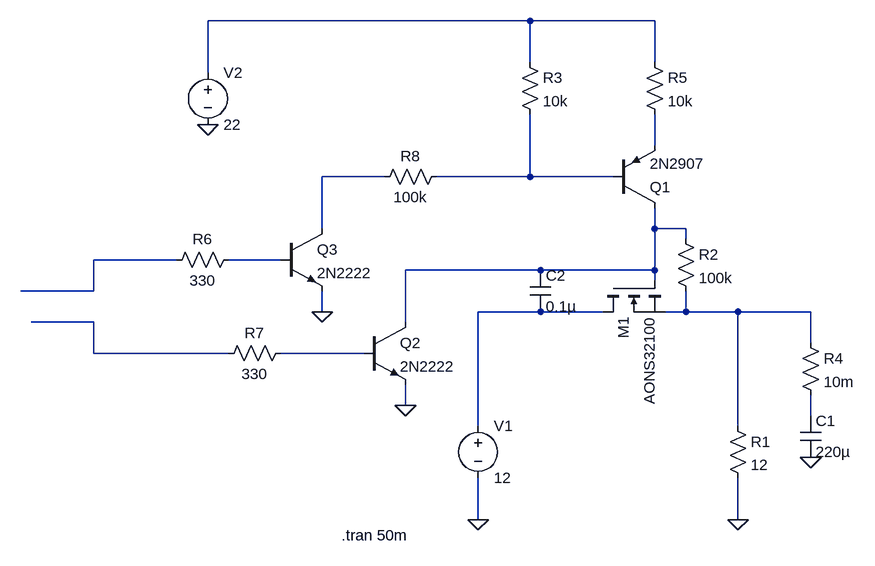
[diagram p0: schematic Power_Switch.asc]
Power_Switch.asc, the LTspice schematic file:
Version 4
SHEET 1 880 680
WIRE -16 -352 -512 -352
WIRE 176 -352 -16 -352
WIRE -16 -288 -16 -352
WIRE 176 -288 176 -352
WIRE -512 -272 -512 -352
WIRE 176 -160 176 -208
WIRE -240 -112 -336 -112
WIRE -16 -112 -16 -208
WIRE -16 -112 -160 -112
WIRE 112 -112 -16 -112
WIRE -336 -32 -336 -112
WIRE 176 -32 176 -64
WIRE 224 -32 176 -32
WIRE 224 -16 224 -32
WIRE -560 16 -688 16
WIRE -400 16 -480 16
WIRE 0 32 -208 32
WIRE 176 32 176 -32
WIRE 176 32 0 32
WIRE 176 48 176 32
WIRE -688 64 -688 16
WIRE -688 64 -800 64
WIRE -336 96 -336 64
WIRE 0 96 -96 96
WIRE 96 96 0 96
WIRE 224 96 224 64
WIRE 224 96 192 96
WIRE 304 96 224 96
WIRE 416 96 304 96
WIRE -688 112 -784 112
WIRE -208 112 -208 32
WIRE 416 144 416 96
WIRE -688 160 -688 112
WIRE -480 160 -688 160
WIRE -272 160 -400 160
WIRE -208 240 -208 208
WIRE 416 256 416 224
WIRE -96 272 -96 96
WIRE 304 272 304 96
WIRE -96 416 -96 352
WIRE 304 416 304 352
FLAG 304 416 0
FLAG -96 416 0
FLAG -512 -192 0
FLAG 416 320 0
FLAG -208 240 0
FLAG -336 96 0
SYMBOL voltage -96 256 R0
SYMATTR InstName V1
SYMATTR Value 12
SYMBOL res 288 256 R0
SYMATTR InstName R1
SYMATTR Value 12
SYMBOL voltage -512 -288 R0
SYMATTR InstName V2
SYMATTR Value 22
SYMBOL nmos 96 48 M90
SYMATTR InstName M1
SYMATTR Value AONS32100
SYMBOL res 208 -32 R0
SYMATTR InstName R2
SYMATTR Value 100k
SYMBOL cap 400 256 R0
SYMATTR InstName C1
SYMATTR Value 220µ
SYMBOL res 400 128 R0
SYMATTR InstName R4
SYMATTR Value 10m
SYMBOL cap -16 32 R0
SYMATTR InstName C2
SYMATTR Value 0.1µ
SYMBOL res 160 -304 R0
SYMATTR InstName R5
SYMATTR Value 10k
SYMBOL npn -272 112 R0
SYMATTR InstName Q2
SYMATTR Value 2N2222
SYMBOL pnp 112 -64 M180
SYMATTR InstName Q1
SYMATTR Value 2N2907
SYMBOL res -32 -304 R0
SYMATTR InstName R3
SYMATTR Value 10k
SYMBOL npn -400 -32 R0
SYMATTR InstName Q3
SYMATTR Value 2N2222
SYMBOL res -464 0 R90
WINDOW 0 0 56 VBottom 2
WINDOW 3 32 56 VTop 2
SYMATTR InstName R6
SYMATTR Value 330
SYMBOL res -384 144 R90
WINDOW 0 0 56 VBottom 2
WINDOW 3 32 56 VTop 2
SYMATTR InstName R7
SYMATTR Value 330
SYMBOL res -144 -128 R90
WINDOW 0 0 56 VBottom 2
WINDOW 3 32 56 VTop 2
SYMATTR InstName R8
SYMATTR Value 100k
TEXT -306 440 Left 2 !.tran 50m

The netlist it stands for:
* Power_Switch.asc
V1 N008 0 12
R1 N009 0 12
V2 N001 0 22
M1 N008 N005 N009 N009 AONS32100
R2 N005 N009 100k
C1 N012 0 220µ
R4 N009 N012 10m
C2 N005 N008 0.1µ
R5 N001 N002 10k
Q2 N005 N011 0 0 2N2222
Q1 N005 N004 N002 0 2N2907
R3 N001 N004 10k
Q3 N003 N007 0 0 2N2222
R6 N007 N006 330
R7 N011 N010 330
R8 N004 N003 100k
.model NPN NPN
.model PNP PNP
.lib standard.bjt
.model NMOS NMOS
.model PMOS PMOS
.lib standard.mos
.tran 50m
.backanno
.end